# Altium project PCB_Project1.PrjPcb
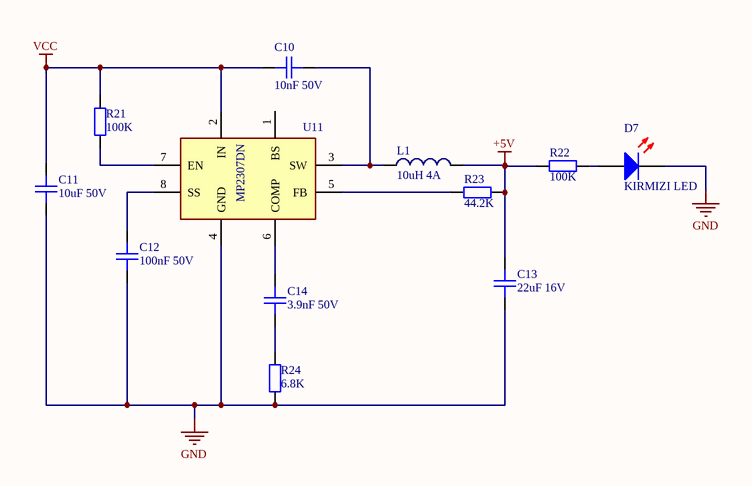
[diagram p0: Power.SchDoc]
3 sheets, 61 parts. Net scope: global (net labels, ports and power ports of the same name join across sheets).
Board file: Copy of PCB_First.PcbDoc
Sheets:
  Power.SchDoc
  Driver.SchDoc
  Atmega328p.SchDoc

## Sheet Power.SchDoc
size A4

### Parts
C10  Deger: 10nF 50V  [CAP 0805/2012]  (hidden comment: CAP CER 10000PF 50V X7R 0805)
C11  Deger: 10uF 50V  [CAP 1206/3216]  (hidden comment: CAP CER 10UF 50V X5R 1206)
C12  Deger: 100nF 50V  [CAP 0805/2012]  (hidden comment: CAP CER 0.1UF 50V X7R 0805)
C13  Deger: 22uF 16V  [CAP 1206/3216]  (hidden comment: CAP CERAMIC 22UF 16V X7S 20% PAD)
C14  Deger: 3.9nF 50V  [CAP 0805/2012]  (hidden comment: CAP CER 3900PF 50V X7R 0805)
D7  Deger: KIRMIZI LED  [SMD: LED 0805/2012 RED]  (hidden comment: Red 645nm LED Indication - Discrete 1.8V 0805)
L1  FIXED IND 10UH 4A 68 MOHM SMD  [ASPI-0630LR-100M-T15]  (value not drawn)
R21  Deger: 100K  [RES_0805]  (hidden comment: RES SMD 100K OHM 1% 1/8W 0805)
R22  Deger: 100K  [RES_0805]  (hidden comment: RES SMD 100K OHM 1% 1/8W 0805)
R23  Deger: 44.2K  [RES_0805]  (hidden comment: RES SMD 44.2K OHM 1% 1/8W 0805)
R24  Deger: 6.8K  [RES_0805]  (hidden comment: RES SMD 6.8K OHM 1% 1/8W 0805)
U11  IC REG BUCK ADJUSTABLE 3A 8SOIC  [SOIC8_PAD]  (value not drawn)

### Nets
+5V: C13.2 L1.2 R22.1 R23.2
GND: C11.1 C12.1 C13.1 D7.2(K) R24.1 U11.4(GND)
VCC: C10.2 C11.2 R21.2 U11.2(IN)
NetC10_1: C10.1 L1.1 U11.3(SW)
NetC12_2: C12.2 U11.8(SS)
NetC14_1: C14.1 R24.2
NetC14_2: C14.2 U11.6(COMP)
NetD7_1: D7.1(A) R22.2
NetR21_1: R21.1 U11.7(EN)
NetR23_1: R23.1 U11.5(FB)

Not connected (* = marked no-connect by the designer): U11 1(BS)

### Library data of the parts
C10 = 10nF 50V 0805: 10000pF ±10% 50V Ceramic Capacitor X7R 0805 (2012 Metric); Cins: Kondansator; Uretici Kodu: CL21B103KBANNNC; Kılıf: 0805; -Sicaklik: -55; +Sicaklik: +125; Lehim Yöntemi: SMD; MSL: 1 (Unlimited)
C11 = 10uF 50V 1206: 10µF ±10% 50V Ceramic Capacitor X5R 1206 (3216 Metric); Cins: Kondansator; Uretici Kodu: CL31A106KBHNNNE; Kılıf: 1206; -Sicaklik: -55; +Sicaklik: +125; Lehim Yöntemi: SMD; MSL: 1 (Unlimited)
C12 = 100nF 50V 0805: 0.1µF ±10% 50V Ceramic Capacitor X7R 0805 (2012 Metric); Kılıf: 0805; Cins: Kondansator; Uretici Kodu: CL21B104KBCNNNC; -Sicaklik: -55; +Sicaklik: +125; Lehim Yöntemi: SMD; MSL: 1 (Unlimited)
C13 = 22uF 16V 1206: 22µF ±20% 16V Ceramic Capacitor X7S 1206 (3216 Metric); Cins: Kondansator; Uretici Kodu: GRM31CC71C226ME11L; Kılıf: 1206; -Sicaklik: -55; +Sicaklik: +125; Lehim Yöntemi: SMD; MSL: 1 (Unlimited)
C14 = 3.9nF 50V 0805: 3900pF ±10% 50V Ceramic Capacitor X7R 0805 (2012 Metric); Cins: Kondansator; Uretici Kodu: CL21B392KBANNNC; Kılıf: 0805; -Sicaklik: -55; +Sicaklik: +125; Lehim Yöntemi: SMD; MSL: 1 (Unlimited)
D7 = LED_Kırmızı: LED RED DIFFUSED 0805 SMD; Uretici Kodu: LH R974-LP-1; Kılıf: 0805; -Sicaklik: -40; +Sicaklik: +125; Cins: LED; Lehim Yöntemi: SMD; MSL: 1 (Unlimited)
L1 = 10uH 4A: 10µH Shielded Molded Inductor 4A 68mOhm Max Nonstandard; Cins: Bobin; -Sicaklik: -55; +Sicaklik: +125; Uretici Kodu: ASPI-0630LR-100M-T15; Kılıf: Nonstandard; Lehim Yöntemi: SMD; MSL: 1 (Unlimited); Deger: 10uH 4A
R21 R22 = 100K 0805: 100 kOhms ±1% 0.125W, 1/8W Chip Resistor 0805 (2012 Metric) Moisture Resistant Thick Film; Cins: Direnc; Uretici Kodu: RC0805FR-07100KL; Kılıf: 0805; -Sicaklik: -55; +Sicaklik: +155; Lehim Yöntemi: SMD; MSL: 1 (Unlimited)
R23 = 44.2K 0805: 44.2 kOhms ±1% 0.125W, 1/8W Chip Resistor 0805 (2012 Metric) Moisture Resistant Thick Film; Cins: Direnc; Uretici Kodu: RC0805FR-0744K2L; Kılıf: 0805; -Sicaklik: -55; +Sicaklik: +155; Lehim Yöntemi: SMD; MSL: 1 (Unlimited)
R24 = 6.8K 0805: 6.8 kOhms ±1% 0.125W, 1/8W Chip Resistor 0805 (2012 Metric) Moisture Resistant Thick Film; Cins: Direnc; Kılıf: 0805; Uretici Kodu: RC0805FR-076K8L; -Sicaklik: -55; +Sicaklik: +155; Lehim Yöntemi: SMD; MSL: 1 (Unlimited)
U11 = MP2307DN: Buck Switching Regulator IC Positive Adjustable 0.925V 1 Output 3A 8-SOIC (0.154", 3.90mm Width) Exposed Pad; Uretici Kodu: MP2307DN-LF-Z; -Sicaklik: -40; +Sicaklik: +85; Lehim Yöntemi: SMD; Cins: IC; Kılıf: 8-SOIC; MSL: 2A (4 Weeks); Deger: MP2307DN

## Sheet Driver.SchDoc
size A4
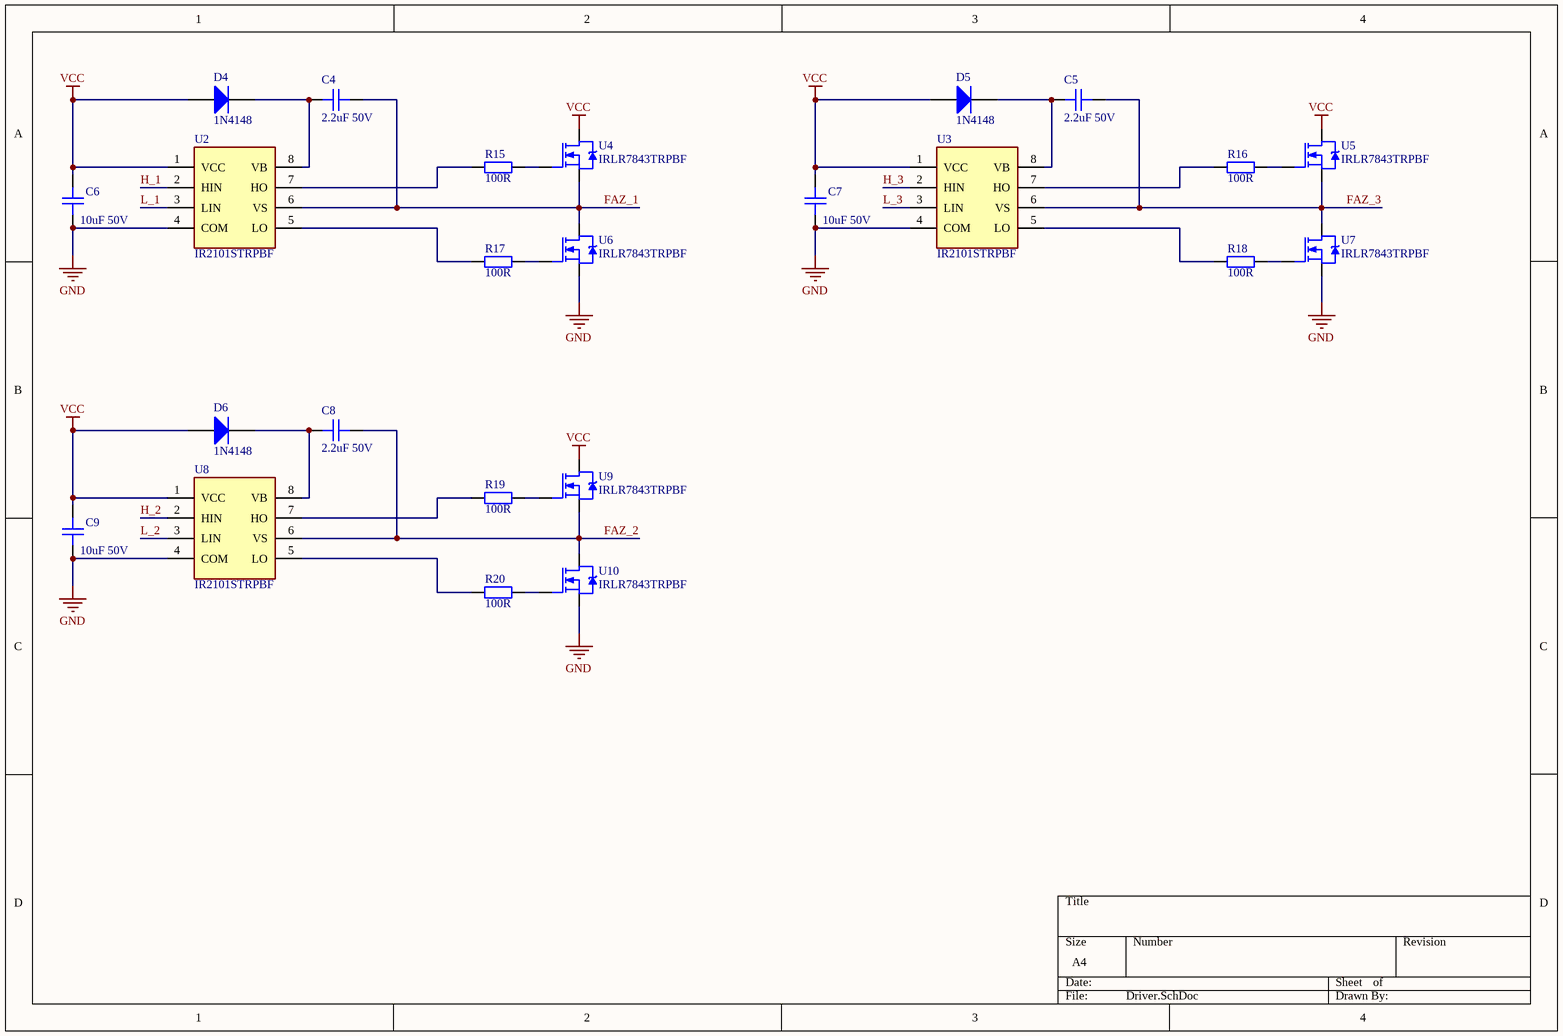
[diagram p1: Driver.SchDoc]

### Parts
C4  Deger: 2.2uF 50V  [CAP 1206/3216]  (hidden comment: CAP CER 2.2UF 50V X5R 1206)
C5  Deger: 2.2uF 50V  [CAP 1206/3216]  (hidden comment: CAP CER 2.2UF 50V X5R 1206)
C6  Deger: 10uF 50V  [CAP 1206/3216]  (hidden comment: CAP CER 10UF 50V X5R 1206)
C7  Deger: 10uF 50V  [CAP 1206/3216]  (hidden comment: CAP CER 10UF 50V X5R 1206)
C8  Deger: 2.2uF 50V  [CAP 1206/3216]  (hidden comment: CAP CER 2.2UF 50V X5R 1206)
C9  Deger: 10uF 50V  [CAP 1206/3216]  (hidden comment: CAP CER 10UF 50V X5R 1206)
D4  1N4148 Diyot  [SOD-123]  (value not drawn)
D5  1N4148 Diyot  [SOD-123]  (value not drawn)
D6  1N4148 Diyot  [SOD-123]  (value not drawn)
R15  Deger: 100R  [RES_0805]  (hidden comment: RES SMD 100 OHM 1% 1/8W 0805)
R16  Deger: 100R  [RES_0805]  (hidden comment: RES SMD 100 OHM 1% 1/8W 0805)
R17  Deger: 100R  [RES_0805]  (hidden comment: RES SMD 100 OHM 1% 1/8W 0805)
R18  Deger: 100R  [RES_0805]  (hidden comment: RES SMD 100 OHM 1% 1/8W 0805)
R19  Deger: 100R  [RES_0805]  (hidden comment: RES SMD 100 OHM 1% 1/8W 0805)
R20  Deger: 100R  [RES_0805]  (hidden comment: RES SMD 100 OHM 1% 1/8W 0805)
U2  Deger: IR2101STRPBF  [SOIC8]  (hidden comment: IC GATE DRVR HALF-BRIDGE 8SOIC)
U3  Deger: IR2101STRPBF  [SOIC8]  (hidden comment: IC GATE DRVR HALF-BRIDGE 8SOIC)
U4  Deger: IRLR7843TRPBF  [DPAK]  (hidden comment: MOSFET N-CH 30V 161A DPAK)
U5  Deger: IRLR7843TRPBF  [DPAK]  (hidden comment: MOSFET N-CH 30V 161A DPAK)
U6  Deger: IRLR7843TRPBF  [DPAK]  (hidden comment: MOSFET N-CH 30V 161A DPAK)
U7  Deger: IRLR7843TRPBF  [DPAK]  (hidden comment: MOSFET N-CH 30V 161A DPAK)
U8  Deger: IR2101STRPBF  [SOIC8]  (hidden comment: IC GATE DRVR HALF-BRIDGE 8SOIC)
U9  Deger: IRLR7843TRPBF  [DPAK]  (hidden comment: MOSFET N-CH 30V 161A DPAK)
U10  Deger: IRLR7843TRPBF  [DPAK]  (hidden comment: MOSFET N-CH 30V 161A DPAK)

### Nets
GND: C6.1 C7.1 C9.1 U2.4(COM) U3.4(COM) U6.3(S) U7.3(S) U8.4(COM) U10.3(S)
VCC: C6.2 C7.2 C9.2 D4.1(A) D5.1(A) D6.1(A) U2.1(VCC) U3.1(VCC) U4.4(D) U5.4(D) U8.1(VCC) U9.4(D)
FAZ_1: C4.1 U2.6(VS) U4.3(S) U6.4(D)
FAZ_2: C8.1 U8.6(VS) U9.3(S) U10.4(D)
FAZ_3: C5.1 U3.6(VS) U5.3(S) U7.4(D)
H_1: U2.2(HIN)
H_2: U8.2(HIN)
H_3: U3.2(HIN)
L_1: U2.3(LIN)
L_2: U8.3(LIN)
L_3: U3.3(LIN)
NetC4_2: C4.2 D4.2(K) U2.8(VB)
NetC5_2: C5.2 D5.2(K) U3.8(VB)
NetC8_2: C8.2 D6.2(K) U8.8(VB)
NetR15_1: R15.1 U2.7(HO)
NetR15_2: R15.2 U4.1(G)
NetR16_1: R16.1 U3.7(HO)
NetR16_2: R16.2 U5.1(G)
NetR17_1: R17.1 U2.5(LO)
NetR17_2: R17.2 U6.1(G)
NetR18_1: R18.1 U3.5(LO)
NetR18_2: R18.2 U7.1(G)
NetR19_1: R19.1 U8.7(HO)
NetR19_2: R19.2 U9.1(G)
NetR20_1: R20.1 U8.5(LO)
NetR20_2: R20.2 U10.1(G)

### Library data of the parts
C4 C5 C8 = 2.2uF 50V 1206: 2.2µF ±10% 50V Ceramic Capacitor X5R 1206 (3216 Metric); Cins: Kondansator; Uretici Kodu: CL31A225KBHNNNE; Kılıf: 1206; -Sicaklik: -55; +Sicaklik: +85; Lehim Yöntemi: SMD; MSL: 1 (Unlimited)
C6 C7 C9 = 10uF 50V 1206: as C11 on sheet Power; MSL: 1 (Unlimited)
D4-D6 = 1N4148: DIODE GEN PURP 100V 150MA SOD123; Uretici Kodu: 1N4148W-TP; -Sicaklik: -65; +Sicaklik: +150; Lehim Yöntemi: SMD; Cins: Diyot; Kılıf: SOD123; MSL: 1 (Unlimited); Deger: 1N4148
R15-R20 = 100R 0805: 100 Ohms ±1% 0.125W, 1/8W Chip Resistor 0805 (2012 Metric) Moisture Resistant Thick Film; Cins: Direnc; Uretici Kodu: RC0805FR-07100RL; Kılıf: 0805; -Sicaklik: -55; +Sicaklik: +155; Lehim Yöntemi: SMD; MSL: 1 (Unlimited)
U2 U3 U8 = IR2101: Half-Bridge Gate Driver IC Non-Inverting 8-SOIC; -Sicaklik: -40; +Sicaklik: +150; Lehim Yöntemi: SMD; Cins: IC; Uretici Kodu: IR2101STRPBF; Kılıf: 8-SOIC; MSL: 2A (4 Weeks)
U4-U7 U9 U10 = IRLR7843: N-Channel 30V 161A (Tc) 140W (Tc) Surface Mount D-Pak; Kılıf: DPAK(TO-252-3); -Sicaklik: -55; +Sicaklik: +175; Lehim Yöntemi: SMD; Cins: MOSFET; Uretici Kodu: IRLR7843TRPBF; MSL: 1 (Unlimited)

## Sheet Atmega328p.SchDoc
size A4
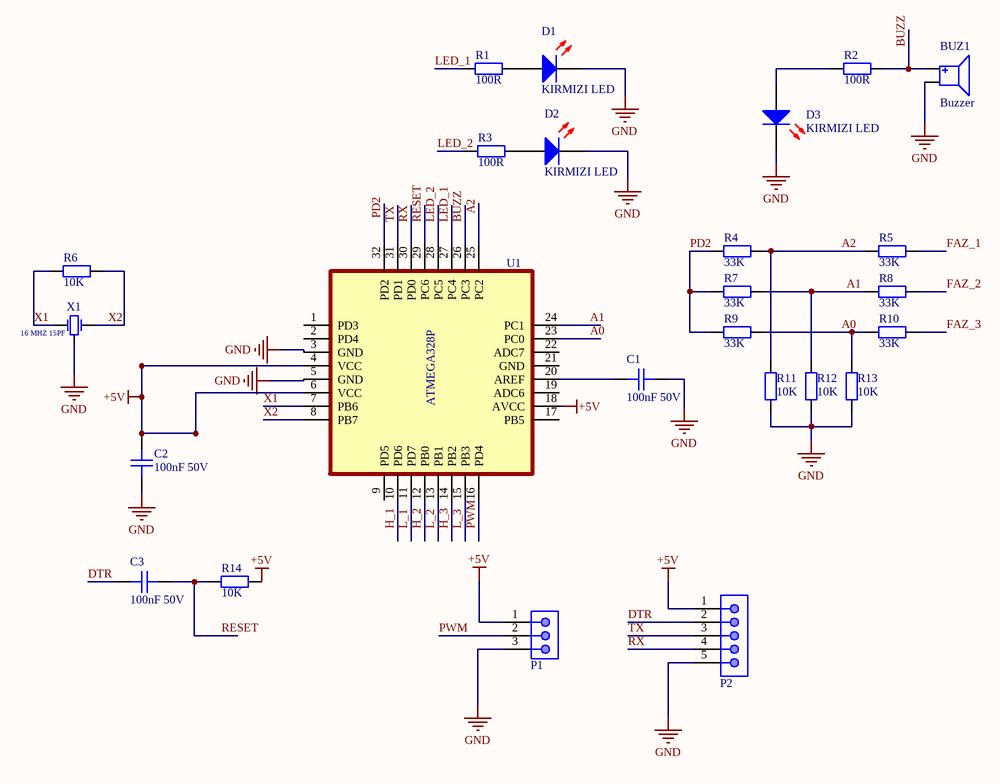
[diagram p2: Atmega328p.SchDoc]

### Parts
BUZ1  Deger: Buzzer  [BUZ: CMT-7525]  (hidden comment: BUZZER MAGN 3.6V 7.5X7.5MM SMD)
C1  Deger: 100nF 50V  [CAP 0805/2012]  (hidden comment: CAP CER 0.1UF 50V X7R 0805)
C2  Deger: 100nF 50V  [CAP 0805/2012]  (hidden comment: CAP CER 0.1UF 50V X7R 0805)
C3  Deger: 100nF 50V  [CAP 0805/2012]  (hidden comment: CAP CER 0.1UF 50V X7R 0805)
D1  Deger: KIRMIZI LED  [SMD: LED 0805/2012 RED]  (hidden comment: Red 645nm LED Indication - Discrete 1.8V 0805)
D2  Deger: KIRMIZI LED  [SMD: LED 0805/2012 RED]  (hidden comment: Red 645nm LED Indication - Discrete 1.8V 0805)
D3  Deger: KIRMIZI LED  [SMD: LED 0805/2012 RED]  (hidden comment: Red 645nm LED Indication - Discrete 1.8V 0805)
P1  WR-PHD 2.54 mm Angled Socket Header  [PWM_CONN]  (value not drawn)
P2  WR-PHD 2.54 mm Angled Socket Header  [TTL_CONN_5]  (value not drawn)
R1  Deger: 100R  [RES_0805]  (hidden comment: RES SMD 100 OHM 1% 1/8W 0805)
R2  Deger: 100R  [RES_0805]  (hidden comment: RES SMD 100 OHM 1% 1/8W 0805)
R3  Deger: 100R  [RES_0805]  (hidden comment: RES SMD 100 OHM 1% 1/8W 0805)
R4  Deger: 33K  [RES_0805]  (hidden comment: RES SMD 33K OHM 1% 1/8W 0805)
R5  Deger: 33K  [RES_0805]  (hidden comment: RES SMD 33K OHM 1% 1/8W 0805)
R6  Deger: 10K  [RES_0805]  (hidden comment: RES SMD 10K OHM 1% 1/8W 0805)
R7  Deger: 33K  [RES_0805]  (hidden comment: RES SMD 33K OHM 1% 1/8W 0805)
R8  Deger: 33K  [RES_0805]  (hidden comment: RES SMD 33K OHM 1% 1/8W 0805)
R9  Deger: 33K  [RES_0805]  (hidden comment: RES SMD 33K OHM 1% 1/8W 0805)
R10  Deger: 33K  [RES_0805]  (hidden comment: RES SMD 33K OHM 1% 1/8W 0805)
R11  Deger: 10K  [RES_0805]  (hidden comment: RES SMD 10K OHM 1% 1/8W 0805)
R12  Deger: 10K  [RES_0805]  (hidden comment: RES SMD 10K OHM 1% 1/8W 0805)
R13  Deger: 10K  [RES_0805]  (hidden comment: RES SMD 10K OHM 1% 1/8W 0805)
R14  Deger: 10K  [RES_0805]  (hidden comment: RES SMD 10K OHM 1% 1/8W 0805)
U1  IC MCU 8BIT 32KB FLASH 32TQFP  [TQFP32]  (value not drawn)
X1  Deger: 16 MHZ 15PF  [CRYSTAL_16MHZ(CTSE16)]  (hidden comment: CERAMIC RES 16.0000MHZ 15PF SMD)

### Nets
+5V: C2.2 P1.1 P2.1 R14.2 U1.4(VCC) U1.6(VCC) U1.18(AVCC)
GND: BUZ1.2(Negative) C1.1 C2.1 D1.2(K) D2.2(K) D3.2(K) P1.3 P2.5 R11.1 R12.1 R13.1 U1.3(GND) U1.5(GND) X1.2(GND)
A0: R9.2 R10.1 R13.2 U1.23(PC0)
A1: R7.2 R8.1 R12.2 U1.24(PC1)
A2: R4.2 R5.1 R11.2 U1.25(PC2)
BUZZ: BUZ1.1(Positive) R2.2 U1.26(PC3)
DTR: C3.1 P2.2
FAZ_1: R5.2
FAZ_2: R8.2
FAZ_3: R10.2
H_1: U1.10(PD6)
H_2: U1.12(PB0)
H_3: U1.14(PB2)
L_1: U1.11(PD7)
L_2: U1.13(PB1)
L_3: U1.15(PB3)
LED_1: R1.1 U1.27(PC4)
LED_2: R3.1 U1.28(PC5)
PD2: R4.1 R7.1 R9.1 U1.32(PD2)
PWM: P1.2 U1.16(PD4)
RESET: C3.2 R14.1 U1.29(PC6)
RX: P2.4 U1.30(PD0)
TX: P2.3 U1.31(PD1)
X1: R6.1 U1.7(PB6) X1.1(OSC1)
X2: R6.2 U1.8(PB7) X1.3(OSC2)
NetC1_2: C1.2 U1.20(AREF)
NetD1_1: D1.1(A) R1.2
NetD2_1: D2.1(A) R3.2
NetD3_1: D3.1(A) R2.1

Not connected (* = marked no-connect by the designer): U1 1(PD3) 2(PD4) 9(PD5) 17(PB5) 19(ADC6) 21(GND) 22(ADC7)

### Library data of the parts
BUZ1 = Buzzer(CMT-7525-80-SMT-TR): Buzzers Transducer, Externally Driven Magnetic 3.6V 100mA 2.73kHz 80dB @ 3.6V, 10cm Surface Mount Solder Pads; Kılıf: Nonstandard; -Sicaklik: -40; +Sicaklik: +85; Cins: Buzzer; Uretici Kodu: CMT-7525-80-SMT-TR; MSL: 1 (Unlimited); Lehim Yöntemi: SMD
C1-C3 = 100nF 50V 0805: as C12 on sheet Power; MSL: 1 (Unlimited)
D1-D3 = LED_Kırmızı: as D7 on sheet Power; Cins: LED; Lehim Yöntemi: SMD; MSL: 1 (Unlimited)
P1 = HDR(1X3): Cins: Konnektor; Uretici Kodu: 613003143121; Kılıf: 3POS 2.54MM; -Sicaklik: -40; +Sicaklik: +105; Lehim Yöntemi: MANUEL; MSL: 1 (Unlimited)
P2 = HDR(1X5): Cins: Konnektor; Uretici Kodu: 613005143121; Kılıf: 5POS 2.54MM; -Sicaklik: -40; +Sicaklik: +105; Lehim Yöntemi: MANUEL; MSL: 1 (Unlimited)
R1-R3 = 100R 0805: as R15 on sheet Driver; Lehim Yöntemi: SMD; MSL: 1 (Unlimited)
R4 R5 R7-R10 = 33K 0805: 33 kOhms ±1% 0.125W, 1/8W Chip Resistor 0805 (2012 Metric) Moisture Resistant Thick Film; Cins: Direnc; Kılıf: 0805; -Sicaklik: -55; +Sicaklik: +155; Uretici Kodu: RC0805FR-0733KL; MSL: 1 (Unlimited); Lehim Yöntemi: SMD
R6 R11-R14 = 10K 0805: 10 kOhms ±1% 0.125W, 1/8W Chip Resistor 0805 (2012 Metric) Moisture Resistant Thick Film; Cins: Direnc; Kılıf: 0805; Uretici Kodu: RC0805FR-0710KL; -Sicaklik: -55; +Sicaklik: +155; Lehim Yöntemi: SMD; MSL: 1 (Unlimited)
U1 = ATMEGA328P: AVR AVR® ATmega Microcontroller IC 8-Bit 20MHz 32KB (16K x 16) FLASH 32-TQFP (7x7); Uretici Kodu: RC0805FR-07100RL; -Sicaklik: -40; +Sicaklik: +85; Lehim Yöntemi: SMD; Cins: IC; Kılıf: 32-TQFP; MSL: 3 (168 Hours); Deger: ATMEGA328P
X1 = CRYSTAL 16.0000MHZ(CSTCE16M0V53-R0): 16MHz Ceramic Resonator Built in Capacitor 15pF ±0.3%  -20°C ~ 80°C Surface Mount; Cins: Kristal; Kılıf: 3-SMD; -Sicaklik: -20; +Sicaklik: +80; Uretici Kodu: CSTCE16M0V53-R0; Lehim Yöntemi: SMD; MSL: 1 (Unlimited)

## Nets that join several sheets
+5V: Power (C13.2 L1.2 R22.1 R23.2), Atmega328p (7 pins)
GND: Power (6 pins), Driver (9 pins), Atmega328p (14 pins)
VCC: Power (C10.2 C11.2 R21.2 U11.2), Driver (12 pins)
FAZ_1: Driver (C4.1 U2.6 U4.3 U6.4), Atmega328p (R5.2)
FAZ_2: Driver (C8.1 U8.6 U9.3 U10.4), Atmega328p (R8.2)
FAZ_3: Driver (C5.1 U3.6 U5.3 U7.4), Atmega328p (R10.2)
H_1: Driver (U2.2), Atmega328p (U1.10)
H_2: Driver (U8.2), Atmega328p (U1.12)
H_3: Driver (U3.2), Atmega328p (U1.14)
L_1: Driver (U2.3), Atmega328p (U1.11)
L_2: Driver (U8.3), Atmega328p (U1.13)
L_3: Driver (U3.3), Atmega328p (U1.15)